# Altium schematic sheet Sheet1.SchDoc
size A4
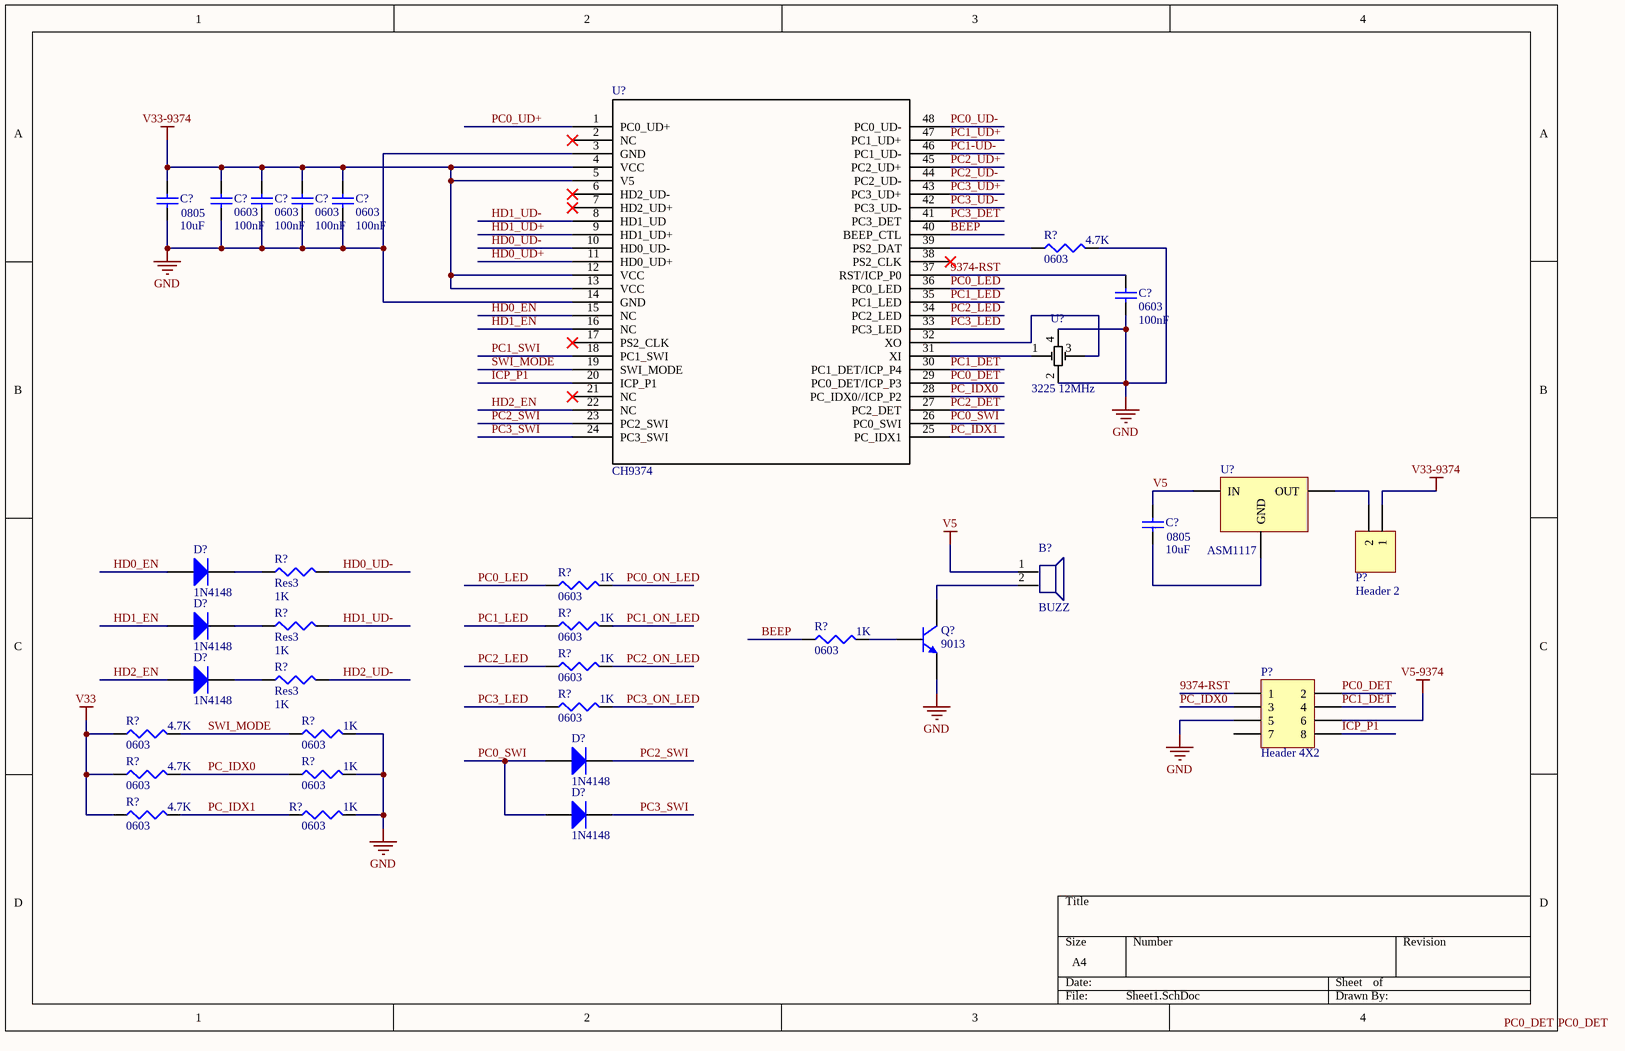
[diagram p0: Sheet1.SchDoc]

## Parts
(Parts that share a designator on the sheet are numbered #1, #2 ... from top to bottom, then left to right.)
B?  BUZZ  [BUZZ]
C?#1  0805  value 10uF  [C1206]
C?#2  0603  value 100nF  [1608[0603]]
C?#3  0603  value 100nF  [1608[0603]]
C?#4  0603  value 100nF  [1608[0603]]
C?#5  0603  value 100nF  [1608[0603]]
C?#6  0603  value 100nF  [1608[0603]]
C?#7  0805  value 10uF  [C1206]
D?#1  1N4148  [DO-35]
D?#2  1N4148  [DO-35]
D?#3  1N4148  [DO-35]
D?#4  1N4148  [DO-35]
D?#5  1N4148  [DO-35]
P?#1  Header 2  [HDR1X2]
P?#2  Header 4X2  [HDR2X4]
Q?  9013  [TO-226-AA]
R?#1  0603  value 4.7K  [J1-0603]
R?#2  Res3  value 1K  [J1-0603]
R?#3  0603  value 1K  [J1-0603]
R?#4  Res3  value 1K  [J1-0603]
R?#5  0603  value 1K  [J1-0603]
R?#6  0603  value 1K  [J1-0603]
R?#7  0603  value 1K  [J1-0603]
R?#8  Res3  value 1K  [J1-0603]
R?#9  0603  value 1K  [J1-0603]
R?#10  0603  value 4.7K  [J1-0603]
R?#11  0603  value 1K  [J1-0603]
R?#12  0603  value 4.7K  [J1-0603]
R?#13  0603  value 1K  [J1-0603]
R?#14  0603  value 4.7K  [J1-0603]
R?#15  0603  value 1K  [J1-0603]
U?#1  CH9374  [qfp48-20-0909b]
U?#2  3225 12MHz
U?#3  ASM1117  [SOT-223]

## Nets
GND: C?#1.1 C?#2.1 C?#3.1 C?#4.1 C?#5.1 C?#6.1 P?#2.5 Q?.3(E) R?#1.2 R?#11.2 R?#13.2 R?#15.2 U?#1.3(GND) U?#1.14(GND) U?#2.2
V5: B?.1(VCC) C?#7.2 U?#3.3(IN)
V5-9374: P?#2.6
V33: R?#10.1 R?#12.1 R?#14.1
V33-9374: C?#1.2 C?#2.2 C?#3.2 C?#4.2 C?#5.2 P?#1.1 U?#1.4(VCC) U?#1.5(V5) U?#1.12(VCC) U?#1.13(VCC)
9374-RST: C?#6.2 P?#2.1 U?#1.37(RST/ICP_P0)
BEEP: R?#6.1 U?#1.40(BEEP_CTL)
HD0_EN: D?#1.1(A) U?#1.15(NC)
HD0_UD+: U?#1.11(HD0_UD+)
HD0_UD-: R?#2.2 U?#1.10(HD0_UD-)
HD1_EN: D?#2.1(A) U?#1.16(NC)
HD1_UD+: U?#1.9(HD1_UD+)
HD1_UD-: R?#4.2 U?#1.8(HD1_UD)
HD2_EN: D?#3.1(A) U?#1.22(NC)
HD2_UD-: R?#8.2
ICP_P1: P?#2.8 U?#1.20(ICP_P1)
PC0_DET: P?#2.2 U?#1.29(PC0_DET/ICP_P3)
PC0_LED: R?#3.1 U?#1.36(PC0_LED)
PC0_ON_LED: R?#3.2
PC0_SWI: D?#4.1(A) D?#5.1(A) U?#1.26(PC0_SWI)
PC0_UD+: U?#1.1(PC0_UD+)
PC0_UD-: U?#1.48(PC0_UD-)
PC1-UD-: U?#1.46(PC1_UD-)
PC1_DET: P?#2.4 U?#1.30(PC1_DET/ICP_P4)
PC1_LED: R?#5.1 U?#1.35(PC1_LED)
PC1_ON_LED: R?#5.2
PC1_SWI: U?#1.18(PC1_SWI)
PC1_UD+: U?#1.47(PC1_UD+)
PC2_DET: U?#1.27(PC2_DET)
PC2_LED: R?#7.1 U?#1.34(PC2_LED)
PC2_ON_LED: R?#7.2
PC2_SWI: D?#4.2(K) U?#1.23(PC2_SWI)
PC2_UD+: U?#1.45(PC2_UD+)
PC2_UD-: U?#1.44(PC2_UD-)
PC3_DET: U?#1.41(PC3_DET)
PC3_LED: R?#9.1 U?#1.33(PC3_LED)
PC3_ON_LED: R?#9.2
PC3_SWI: D?#5.2(K) U?#1.24(PC3_SWI)
PC3_UD+: U?#1.43(PC3_UD+)
PC3_UD-: U?#1.42(PC3_UD-)
PC_IDX0: P?#2.3 R?#12.2 R?#13.1 U?#1.28(PC_IDX0//ICP_P2)
PC_IDX1: R?#14.2 R?#15.1 U?#1.25(PC_IDX1)
SWI_MODE: R?#10.2 R?#11.1 U?#1.19(SWI_MODE)
NetB?_2: B?.2(GND) Q?.1(C)
NetC?#7_1: C?#7.1 U?#3.1(GND)
NetD?#1_2: D?#1.2(K) R?#2.1
NetD?#2_2: D?#2.2(K) R?#4.1
NetD?#3_2: D?#3.2(K) R?#8.1
NetP?#1_2: P?#1.2 U?#3.2(OUT)
NetQ?_2: Q?.2(B) R?#6.2
NetR?#1_1: R?#1.1 U?#1.39(PS2_DAT)
NetU?#1_31: U?#1.31(XI) U?#2.1

Not connected (* = marked no-connect by the designer): P?#2 7; U?#1 2(NC)* 6(HD2_UD-)* 7(HD2_UD+)* 17(PS2_CLK)* 21(NC)* 32(XO) 38(PS2_CLK)*; U?#2 3 4

## Notes on the sheet
- Labels drawn without touching a wire or pin: PC0_DET

## Library data of the parts
C?#1-C?#7 = Cap Semi: Capacitor (Semiconductor SIM Model); Published: 8-Jun-2000; LatestRevisionDate: 29-May-2009; LatestRevisionNote: IPC-7351 Footprint Added.; PackageReference: C1206; Publisher: Altium Limited; PackageDescription: Chip Capacitor
D?#1-D?#5 = Diode 1N4148: High Conductance Fast Diode; Published: 8-Jun-2000; LatestRevisionDate: 17-Jul-2002; LatestRevisionNote: Re-released for DXP Platform.; DatasheetVersion: 1997; PackageReference: DO-35; Publisher: Altium Limited; PackageDescription: Diode, Axial; Body 3.8 x 1.9 mm (LxDia. max), Lead Dia. 0.53 mm (max); Code_JEDEC: DO-204-AH; ComponentLink1Description: Manufacturer Link; ComponentLink1URL: http://www.fairchildsemi.com/; ComponentLink2Description: Datasheet; ComponentLink2URL: http://www.fairchildsemi.com/ds/1N%2F1N4148.pdf
P?#1 = Header 2: Header, 2-Pin; LatestRevisionDate: 17-Jul-2002; LatestRevisionNote: Re-released for DXP Platform.; Publisher: Altium Limited
P?#2 = Header 4X2: Header, 4-Pin, Dual row; LatestRevisionDate: 17-Jul-2002; LatestRevisionNote: Re-released for DXP Platform.; Publisher: Altium Limited
Q? = NPN: NPN Bipolar Transistor; Published: 8-Jun-2000; LatestRevisionDate: 17-Jul-2002; LatestRevisionNote: Re-released for DXP Platform.; PackageReference: TO-226-AA; Publisher: Altium Limited; PackageDescription: TO, Flat Index; 3 In-Line, Axial Leads; Body Dia. 4.8mm; Leads 0.55 x 0.51 mm (max); Code_JEDEC: TO-226-AA
R?#1-R?#15 = Res3: Resistor; Published: 8-Jun-2000; LatestRevisionDate: 29-May-2009; LatestRevisionNote: IPC-7351 Footprint Added.; PackageReference: J1-0603; Publisher: Altium Limited; PackageDescription: Chip Resistor
U?#1 = CH9374: Imported; RefDes: RefDes; Type: DEV; Value: Value
U?#2 = Component_1